# EAGLE design power_shield_v1 (EAGLE 6.5.0)
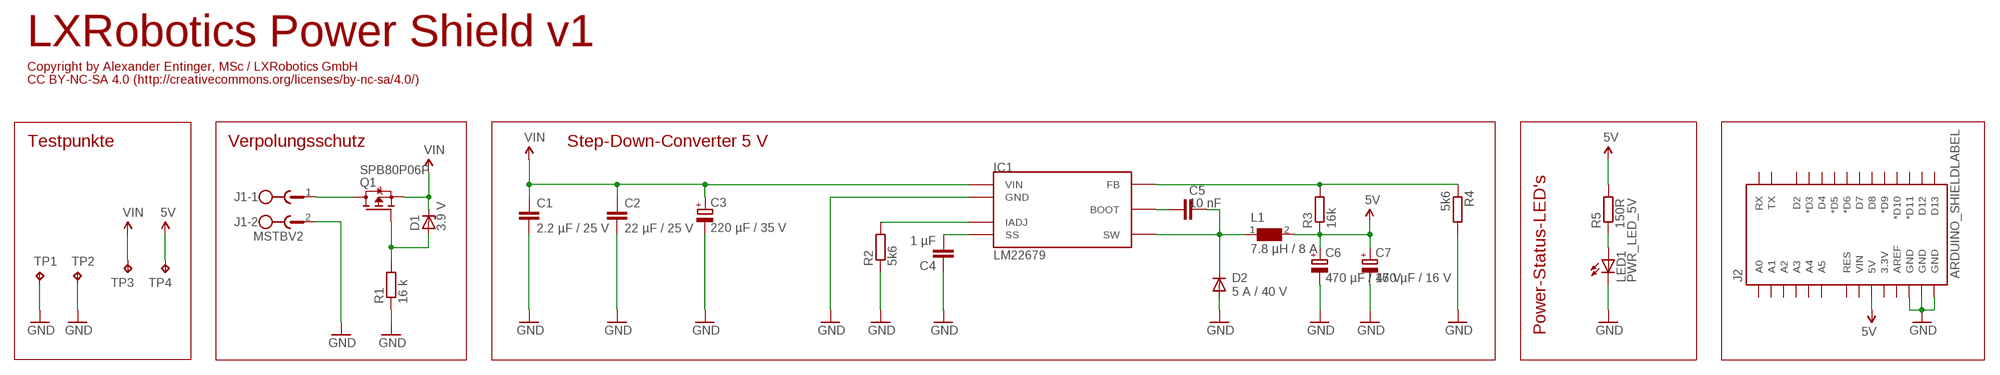
[diagram p0: schematic, sheet 1]

## Parts
C1  2.2 µF / 25 V  C-EUC1206  [C1206]
C2  22 µF / 25 V  C-EUC1210  [C1210]
C3  220 µF / 35 V  CPOL-EUF  [PANASONIC_F]
C4  1 µF  C-EUC0805  [C0805]
C5  10 nF  C-EUC0805  [C0805]
C6  470 µF / 16 V  CPOL-EUF  [PANASONIC_F]
C7  470 µF / 16 V  CPOL-EUF  [PANASONIC_F]
D1  3.9 V  ZENER-DIODESMB  [SMB]
D2  5 A / 40 V  DIODE-SMC  [SMC]
IC1  LM22679  [P-TO263-7-1]
J1  MSTBV2  [MSTBV2]
J2  ARDUINO_SHIELDLABEL  [DUEMILANOVE_SHIELD]
L1  7.8 µH / 8 A  WE-HCI-744325780_1050  [WE-HCI_1050]
LED1  PWR_LED_5V  LEDCHIPLED_0805  [CHIPLED_0805]
Q1  SPB80P06P  [TO263]
R1  16 k  R-EU_M0805  [M0805]
R2  5k6  R-EU_M0805  [M0805]
R3  16k  R-EU_M0805  [M0805]
R4  5k6  R-EU_M0805  [M0805]
R5  150R  R-EU_M0805  [M0805]
TP1  TPB1,27  [B1,27]
TP2  TPB1,27  [B1,27]
TP3  TPB1,27  [B1,27]
TP4  TPB1,27  [B1,27]

## Nets
5V: C6.+ C7.+ J2.5V L1.2 R3.1 R5.2 TP4.TP
GND: C1.2 C2.2 C3.- C4.1 C6.- C7.- D2.A IC1.4(GND) IC1.TH(GND) J1.2 J2.GND@0(GND) J2.GND@1(GND) J2.GND@2(GND) LED1.C R1.1 R2.1 R4.2 TP1.TP TP2.TP
N$1: IC1.5(IADJ) R2.2
N$2: C4.2 IC1.7(SS)
N$3: IC1.6(FB) R3.2 R4.1
N$4: C5.1 IC1.3(BOOT)
N$5: C5.2 D2.C IC1.1(SW) L1.1
N$9: LED1.A R5.1
N$32: D1.A Q1.1(G) R1.2
N$38: J1.1 Q1.3(D)
VIN: C1.1 C2.1 C3.+ D1.C IC1.2(VIN) Q1.2(S) TP3.TP
Unconnected: J2.3.3V J2.A0 J2.A1 J2.A2 J2.A3 J2.A4 J2.A5 J2.AREF J2.D2 J2.D3(*D3) J2.D4 J2.D5(*D5) J2.D6(*D6) J2.D7 J2.D8 J2.D9(*D9) J2.D10(*D10) J2.D11(*D11) J2.D12 J2.D13 J2.RES J2.RX J2.TX J2.VIN

## Notes on the sheet
- LXRobotics Power Shield v1
- Copyright by Alexander Entinger, MSc / LXRobotics GmbH 
  CC BY-NC-SA 4.0 (http://creativecommons.org/licenses/by-nc-sa/4.0/)
- Testpunkte | Verpolungsschutz | Step-Down-Converter 5 V
- Power-Status-LED's

## Library data of the parts
C1 C2 C4 C5 = resistor:C-EU: CAPACITOR, European symbol
C3 C6 C7 = resistor:CPOL-EU: POLARIZED CAPACITOR, European symbol
D1 = diode:ZENER-DIODE: Z-Diode
D2 = diode:DIODE-: DIODE
IC1 = lxrobotics_ic:LM22679: Step-Down-Converter-IC bis zu 5 A Ausgangsstrom Farnell-Bestellnummer: 1657731 http://at.farnell.com/texas-instruments/lm22679tj-adj/regler-einst-spannung-5a-7to263/dp/1657731
J1 = con-phoenix-508:MSTBV2: PHOENIX; MPN: MSTBV 2,5/2-GF-5.08; OC_FARNELL: 1792792; OC_NEWARK: 69R9845
J2 = SparkFun-Boards:ARDUINO_SHIELD: Arduino shield footprint
L1 = WE-HCI:WE-HCI: SMD-Flat Wire High Current Inductor WE-HCI - Flat wire coil for lower losses at high frequency ranges - Low leakage field - Extremely low profile design - Current loading up to 40 A - Magnetically shielded -- Graphic cards -- Laptops -- Motherboards -- High current switching regulators -- Polyphase-switching regulators -- industrial computers; MPN: 744325780; OC_FARNELL: 2211623; OC_NEWARK: 44W4641; PACKAGE: 1050; SUPPLIER: Würth Elektronik eiSos GmbH
LED1 = led:LED: LED OSRAM: - CHIPLED LG R971, LG N971, LY N971, LG Q971, LY Q971, LO R971, LY R971 LH N974, LH R974 LS Q976, LO Q976, LY Q976 LO Q996 - Hyper CHIPLED LW Q18S LB Q993, LB Q99A, LB R99A - SideLED LS A670, LO A670, LY A670, LG A670, LP A670 LB A673, LV A673, LT A673, LW A673 LH A674 LY A675 LS A676, LA A676, LO A676, LY A676, LW A676 LS A679, LY A679, LG A679 - Hyper Micro SIDELED® LS Y876, LA Y876, LO Y876, LY Y876 LT Y87S - SmartLED LW L88C, LW L88S LB L89C, LB L89S, LG L890 LS L89K, LO L89K, LY L89K LS L896, LA L896, LO L896, LY L896 - TOPLED LS T670, LO T670, LY T670, LG T670, LP T670 LSG T670, LSP T670, LSY T670, LOP T670, LYG T670 LG T671, LOG T671, LSG T671 LB T673, LV T673, LT T673, LW T673 LH T674 LS T676, LA T676, LO T676, LY T676, LB T676, LH T676, LSB T676, LW T676 LB T67C, LV T67C, LT T67C, LS T67K, LO T67K, LY T67K, LW E67C LS E67B, LA E67B, LO E67B, LY E67B, LB E67C, LV E67C, LT E67C LW T67C LS T679, LY T679, LG T679 LS T770, LO T770, LY T770, LG T770, LP T770 LB T773, LV T773, LT T773, LW T773 LH T774 LS E675, LA E675, LY E675, LS T675 LS T776, LA T776, LO T776, LY T776, LB T776 LHGB T686 LT T68C, LB T68C - Hyper Mini TOPLED® LB M676 - Mini TOPLED Santana® LG M470 LS M47K, LO M47K, LY M47K Source: http://www.osram.convergy.de LUXEON: - LUMILED® LXK2-PW12-R00, LXK2-PW12-S00, LXK2-PW14-U00, LXK2-PW14-V00 LXK2-PM12-R00, LXK2-PM12-S00, LXK2-PM14-U00 LXK2-PE12-Q00, LXK2-PE12-R00, LXK2-PE12-S00, LXK2-PE14-T00, LXK2-PE14-U00 LXK2-PB12-K00, LXK2-PB12-L00, LXK2-PB12-M00, LXK2-PB14-N00, LXK2-PB14-P00, LXK2-PB14-Q00 LXK2-PR12-L00, LXK2-PR12-M00, LXK2-PR14-Q00, LXK2-PR14-R00 LXK2-PD12-Q00, LXK2-PD12-R00, LXK2-PD12-S00 LXK2-PH12-R00, LXK2-PH12-S00 LXK2-PL12-P00, LXK2-PL12-Q00, LXK2-PL12-R00 Source: www.luxeon.com KINGBRIGHT: KA-3528ASYC Source: www.kingbright.com
Q1 = transistor-fet:SPB80P06P: SIPMOS (R) Power-Transistor P-Channel, Enhancement mode Source: http://www.infineon.com/upload/Document/cmc_upload/documents/011/3685/SPP80P06P.pdf
R1-R5 = resistor:R-EU_: RESISTOR, European symbol
TP1-TP4 = testpad:TP: Test pad

## Board
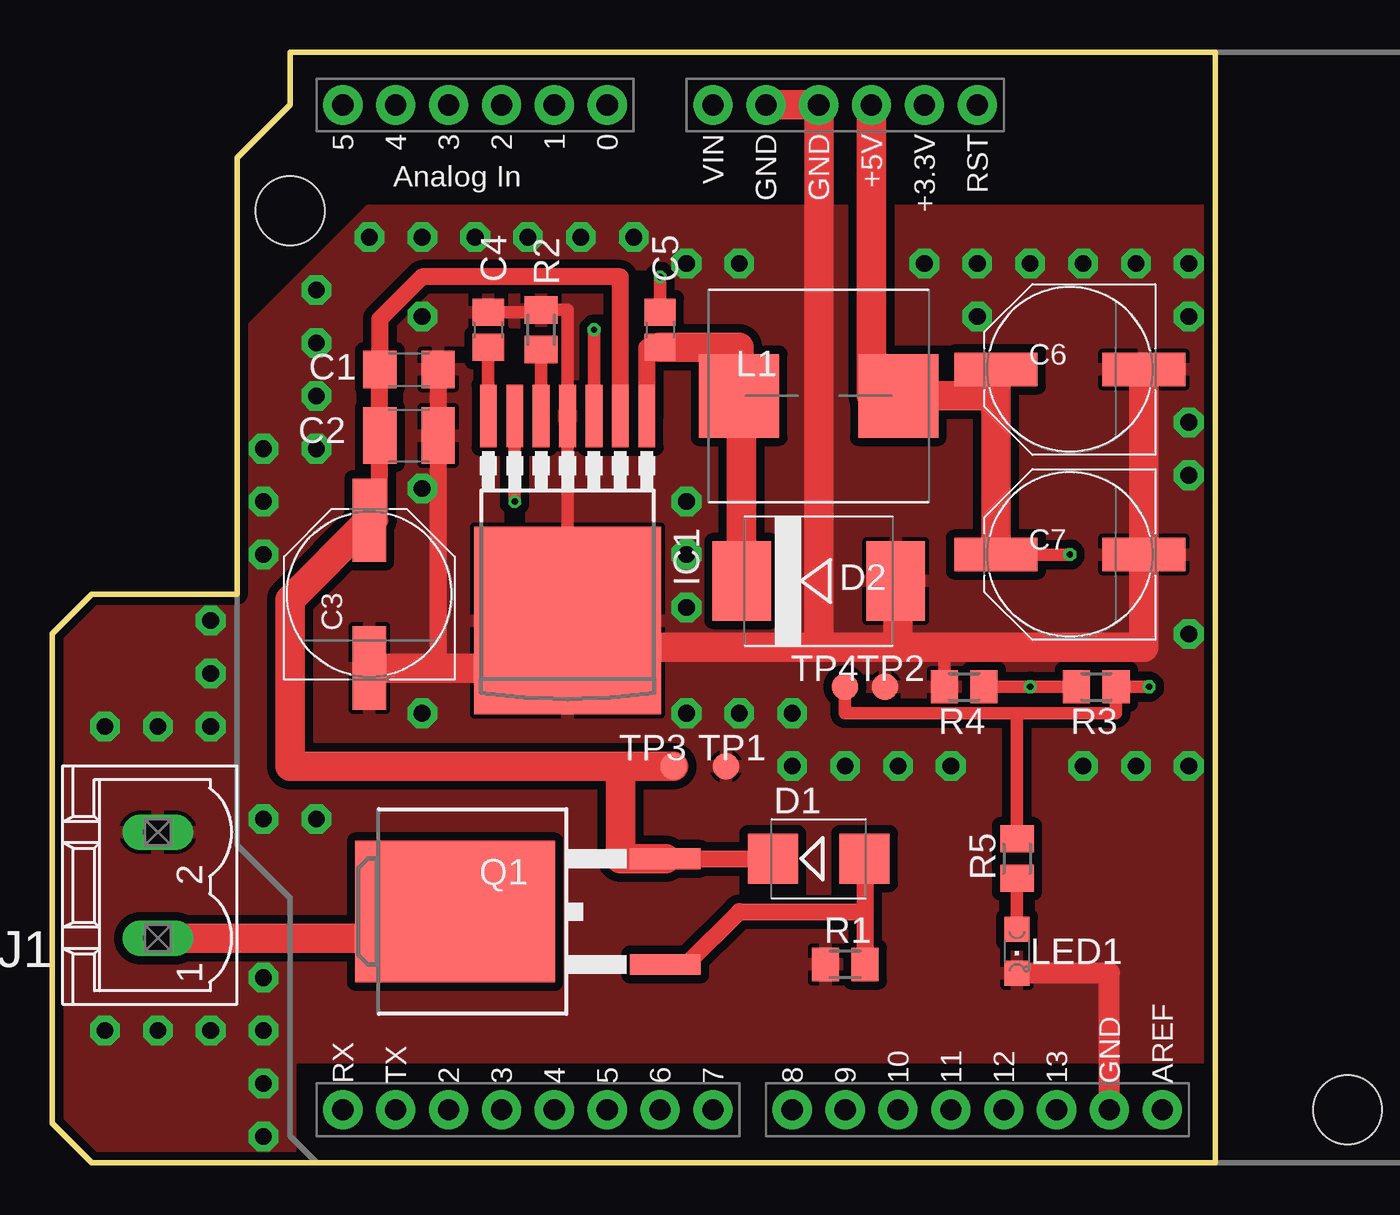
[diagram p1: board, top side]
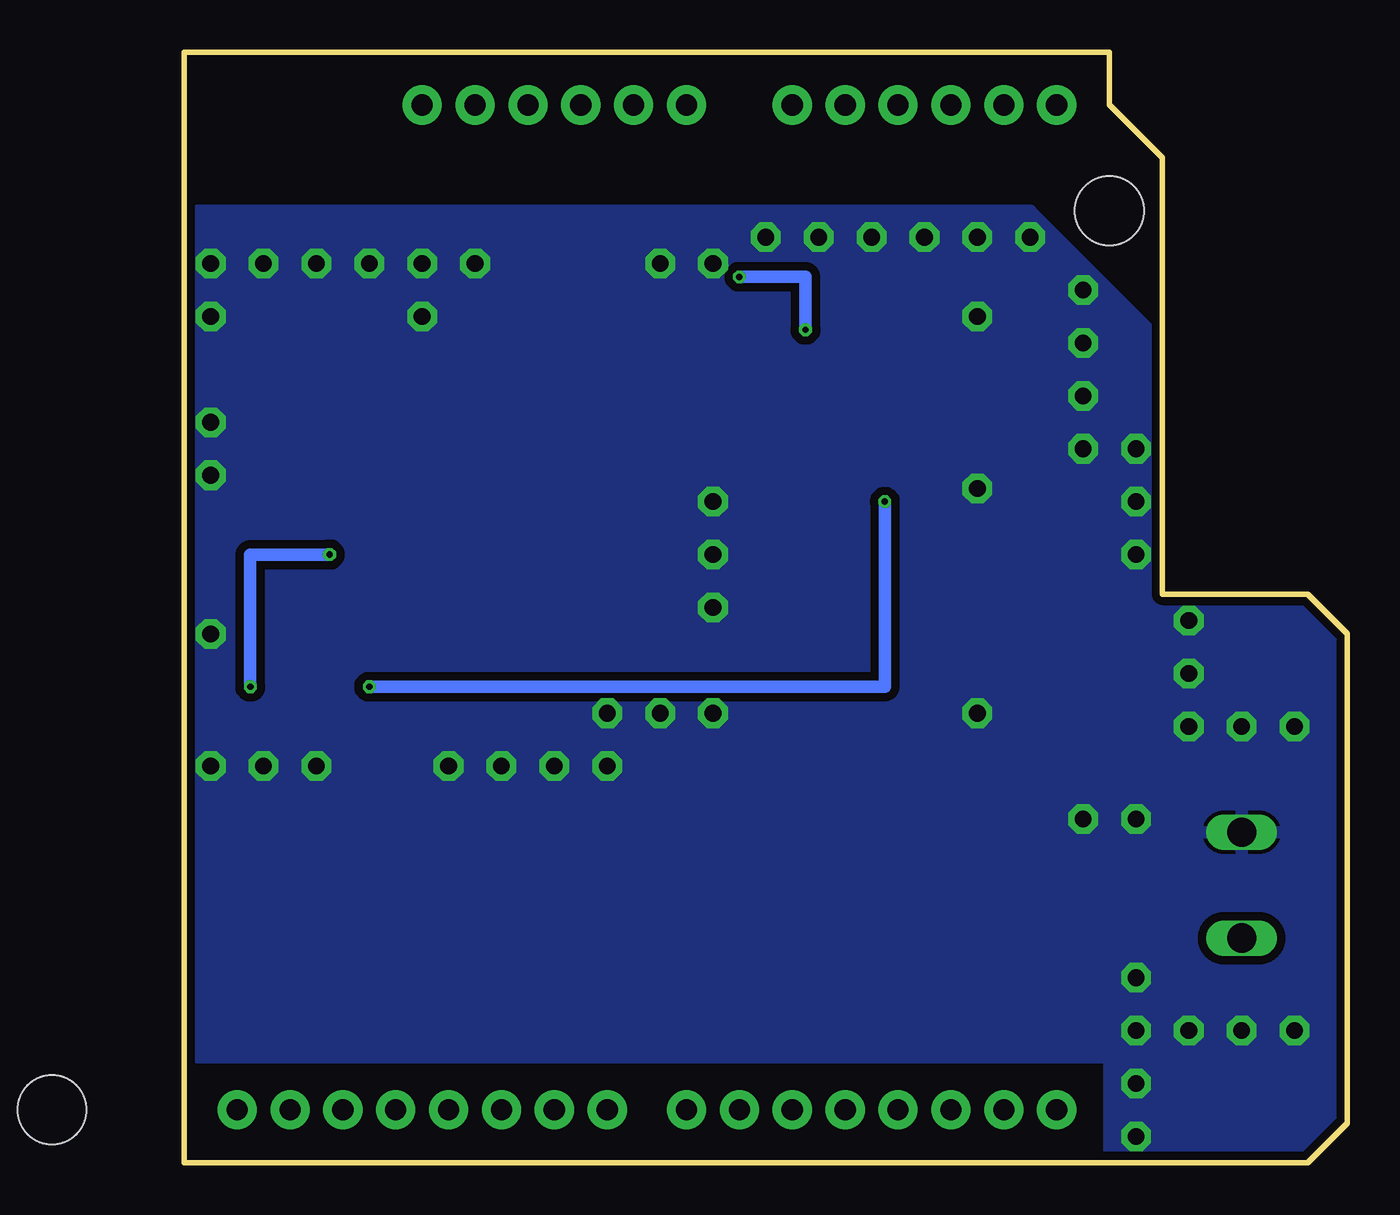
[diagram p2: board, bottom side, seen from below]

Size 55.88 x 53.34 mm. Coordinates in mm from the lower left corner, seen from the top.
Outline: 1.9,0 55.88,0 55.88,53.34 11.43,53.34 11.43,50.8 8.89,48.26 8.89,27.3 1.9,27.3 0,25.4 0,1.91 1.9,0
Copper layers (1*16): Top 0.035mm / dielectric 1.5mm / Bottom 0.035mm
Design rules "LeitOn - Standard-Eagle-DRU - 1- und  2-Lagen DK - deutsch - Rev 2.0": minimum track width 0.15mm, minimum drill 0.3mm, track to track 0.15mm, track to pad 0.15mm, pad to pad 0.15mm, via to via 0.15mm, smd to smd 0.15mm, copper to edge 0.3mm, drill to drill 0.3mm, minimum pad ring 0.15mm, minimum via ring 0.15mm, stop-mask expansion 0.075mm, vias tented up to drill 0mil, thermal gap 0.2mm

### Footprints (pad centres in the part's own frame; a part is rotated, then mirrored left to right if it is on the bottom)
C1206 = smd 1.6 x 1.8: 1 -1.4,0; 2 1.4,0
C1210 = smd 1.6 x 2.7: 1 -1.4,0; 2 1.4,0
PANASONIC_F = smd 4 x 1.6: + 3.55,0; - -3.55,0
C0805 = smd 1.3 x 1.5: 1 -0.85,0; 2 0.85,0
SMB = smd 2.4 x 2.4: A 2.2,0; C -2.2,0
SMC = smd 2.8 x 3.8: A 3.7,0; C -3.7,0
P-TO263-7-1 = smd 0.8 x 3: 1 -3.81,-3.475; 2 -2.54,-3.475; 3 -1.27,-3.475; 4 0,-3.475; 5 1.27,-3.475; 6 2.54,-3.475; 7 3.81,-3.475 | smd 9 x 9: TH 0,6.35
MSTBV2 = drill 1.397 long: 1 -2.54,0; 2 2.54,0
DUEMILANOVE_SHIELD = drill 1.016 pad 1.88: 3.3V 50.8,26.67; 5V 50.8,29.21; A0 50.8,41.91; A1 50.8,44.45; A2 50.8,46.99; A3 50.8,49.53; A4 50.8,52.07; A5 50.8,54.61; AREF 2.54,15.24; D2 2.54,49.53; D3 2.54,46.99; D4 2.54,44.45; D5 2.54,41.91; D6 2.54,39.37; D7 2.54,36.83; D8 2.54,33.02; D9 2.54,30.48; D10 2.54,27.94; D11 2.54,25.4; D12 2.54,22.86; D13 2.54,20.32; GND@0 50.8,31.75; GND@1 50.8,34.29; GND@2 2.54,17.78; RES 50.8,24.13; RX 2.54,54.61; TX 2.54,52.07; VIN 50.8,36.83 | hole 3.302: 45.72,57.15; 2.54,6.35
WE-HCI_1050 = smd 3.85 x 4: 1 -3.825,0; 2 3.825,0
CHIPLED_0805 = smd 1.2 x 1.2: A 0,-1.05; C 0,1.05
TO263 = smd 1 x 3.4: 1 -2.54,-6.6; 2 2.54,-6.6 | smd 6.8 x 9.6: 3 0,3.5
M0805 = smd 1.3 x 1.6: 1 -0.95,0; 2 0.95,0
B1,27 = smd 1.27 x 1.27: TP 0,0

### Placement (x,y rotation side)
C1  17.14,38.1 0 top
C2  17.14,34.92 0 top
C3  15.24,27.3 90 top
C4  20.96,40.01 270 top
C5  29.21,40.01 270 top
C6  48.89,38.1 180 top
C7  48.89,29.21 180 top
D1  36.83,14.61 0 top
D2  36.83,27.94 0 top
IC1  24.77,32.38 180 top
J1  5.08,13.34 90 top
J2  68.58,0 90 top
L1  36.83,36.83 0 top
LED1  46.35,10.16 180 top
Q1  22.86,12.06 90 top
R1  38.1,9.53 0 top
R2  23.5,40.01 270 top
R3  50.16,22.86 180 top
R4  43.81,22.86 180 top
R5  46.35,14.61 90 top
TP1  32.38,19.05 0 top
TP2  40,22.86 0 top
TP3  29.84,19.05 0 top
TP4  38.1,22.86 90 top

### Tracks (layer width: path | path; a pad name or v marks a point on that pad's centre or on a via)
5V  (via drill 0.3)
  Top 0.61: v52.7,22.86 R3.1 51.11,21.59 46.35,21.59 | v48.89,29.21 C7.+ | TP4.TP 38.1,21.59 46.35,21.59 | R5.2 46.35,21.59
  Top 1.422: C7.+ C6.+ 45.34,36.83 L1.2 39.37,36.83 J2.5V
  Bottom 0.61: v52.7,22.86 52.7,29.21 v48.89,29.21
GND  (via drill 0.8 pad 1.42)
  Top 0.61: 24.77,25.4 IC1.4 24.77,40.95 R2.1 23.5,40.85 C4.1 | R4.2 42.86,24.45 43.18,24.77
  Top 0.813: 18.41,23.75 18.55,23.89 C2.2 C1.2
  Top 1.016: J2.GND@2 50.8,9.11 LED1.C
  Top 1.422: C6.- C7.- 52.45,24.77 43.18,24.77 40.64,24.77 | D2.A 40.64,27.94 40.64,24.77 | IC1.TH 24.77,25.4 24.77,24.77 | 24.77,24.77 36.83,24.77 | 36.83,24.77 40.64,24.77 | C3.- 18.41,23.75 24.77,23.75 24.77,24.77 | 36.83,24.77 J2.GND@0 J2.GND@1
  other vias: 2.54,6.35 5.08,6.35 7.62,6.35 10.16,1.27 10.16,3.81 10.16,6.35 10.16,8.89 10.16,16.51 12.7,16.51 35.56,19.05 38.1,19.05 40.64,19.05 43.18,19.05 49.53,19.05 52.07,19.05 54.61,19.05 54.61,25.4 54.61,33.02 54.61,35.56 54.61,40.64 54.61,43.18 52.07,43.18 49.53,43.18 46.99,43.18 44.45,40.64 44.45,43.18 41.91,43.18 33.02,43.18 30.48,43.18 27.94,44.45 25.4,44.45 22.86,44.45 20.32,44.45 17.78,44.45 15.24,44.45 12.7,41.91 12.7,39.37 12.7,36.83 12.7,34.29 10.16,34.29 10.16,31.75 10.16,29.21 30.48,26.67 30.48,29.21 30.48,31.75 17.78,40.64 17.78,32.38 17.78,21.59 30.48,21.59 33.02,21.59 35.56,21.59 5.08,20.95 7.62,20.95 2.54,20.95 7.62,23.5 7.62,26.04
  pour Bottom (isolate 0.406): 0.64,1.91 1.9,0.64 11.43,0.64 11.43,5.08 55.24,5.08 55.24,45.72 15.24,45.72 9.53,40.01 9.53,27.3 0,27.3
  pour Top (isolate 0.406): 0.64,1.91 1.9,0.64 11.43,0.64 11.43,5.08 55.24,5.08 55.24,45.72 15.24,45.72 9.53,40.01 9.53,27.3 0,27.3
N$1
  Top 0.61: IC1.5 R2.2
N$2
  Top 0.61: IC1.7 C4.2
N$3  (via drill 0.3)
  Top 0.61: R3.2 v46.99,22.86 R4.1 | v22.23,31.75 IC1.6
  Bottom 0.61: v46.99,22.86 22.23,22.86 v22.23,31.75
N$4  (via drill 0.3)
  Top 0.61: C5.1 v29.21,42.55 | v26.04,40.01 IC1.3
  Bottom 0.61: v29.21,42.55 26.04,42.55 v26.04,40.01
N$5
  Top 0.813: IC1.1 28.57,39.16 C5.2
  Top 1.422: D2.C 33.13,36.83 L1.1 33,39.16 C5.2
N$9
  Top 0.61: R5.1 LED1.A
N$32
  Top 0.813: Q1.1 30.48,9.53 33.02,12.06 39.05,12.06 | 39.05,12.06 R1.2 | D1.A 39.05,14.61 39.05,12.06
N$38
  Top 1.422: J1.1 19.68,10.79 19.68,12.7 19.36,12.7 Q1.3
VIN
  Top 0.813: C3.+ 15.75,30.86 C2.1 C1.1 15.75,40.51 17.78,42.55 27.3,42.55 IC1.2 | Q1.2 D1.C
  Top 1.422: Q1.2 27.3,14.61 27.3,19.05 | 27.3,19.05 11.43,19.05 11.43,27.05 C3.+ | 27.3,19.05 TP3.TP